# Altium schematic sheet Transistor - Mosfet.SchDoc
size A3; SheetNumber: 38; SheetTotal: 38
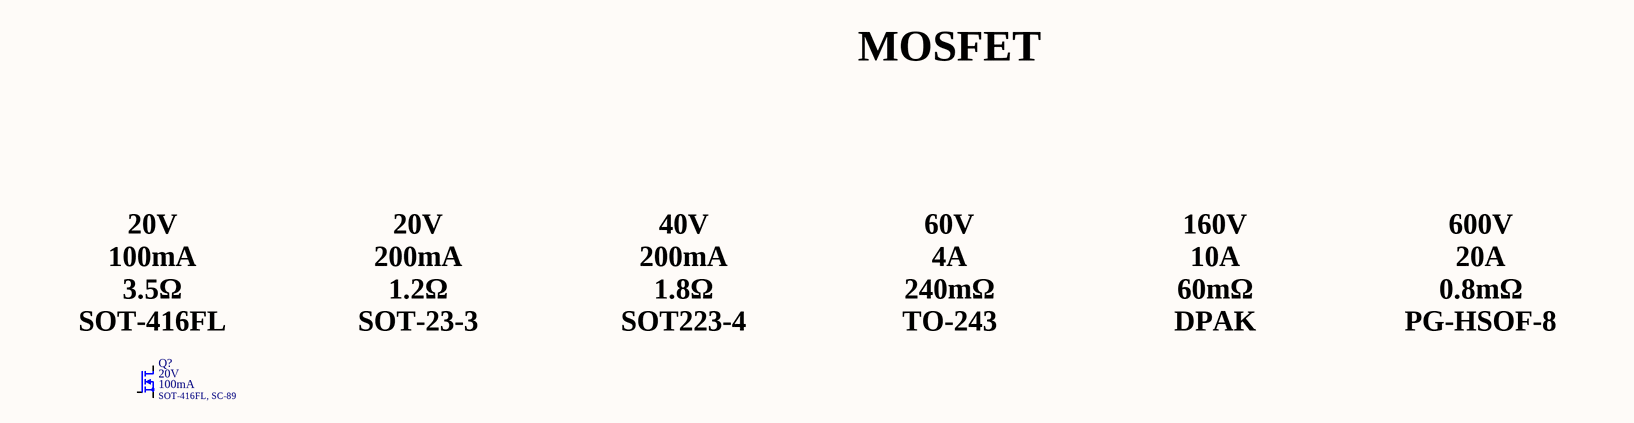
[diagram p0: Transistor - Mosfet.SchDoc]

## Parts
Q?  Current: 100mA  Voltage: 20V  Package: SOT-416FL, SC-89  [SOT-416FL, Mosfet - Type 1]  (hidden comment: Mosfet, N-Channel)

## Nets

Not connected (* = marked no-connect by the designer): Q? D G S

## Notes on the sheet
- MOSFET
- (near Q?) 20V
  100mA
  3.5Ω
  SOT-416FL
- 20V
  200mA
  1.2Ω
  SOT-23-3
- 40V
  200mA
  1.8Ω
  SOT223-4
- 60V
  4A
  240mΩ
  TO-243
- 160V
  10A
  60mΩ
  DPAK
- 600V
  20A
  0.8mΩ
  PG-HSOF-8

## Library data of the parts
Q? = Mosfet, N-Channel: MOSFET, N-CH, 20V, 100mA, SOT-416FL; Manufacturer Part Number: RE1C001UNTCL; Manufacturer: Rohm; Component Category: Transistor; ComponentLink1Description: Datasheet; ComponentLink1URL: E:\Altium\Datasheets\Transistor\Rohm, RE1C001UN.pdf; ComponentLink2Description: Supplier Link; ComponentLink2URL: https://www.digikey.com/en/products/detail/rohm-semiconductor/RE1C001UNTCL/4004557; Supplier: Digikey; Supplier Part Number: RE1C001UNTCLCT-ND; Operating Temperature, Min: *℃; Operating Temperature, Max: *℃; Quantity, Min: 1; Quantity, Max: 6000; Price, Min: 0.42; Price, Max: 0.0638; Supplier Currency: $; Supplier Link: https://www.digikey.com/en/products/detail/rohm-semiconductor/RE1C001UNTCL/4004557; Component Type: Mosfet